# Altium schematic sheet Fonte.SchDoc
size A4
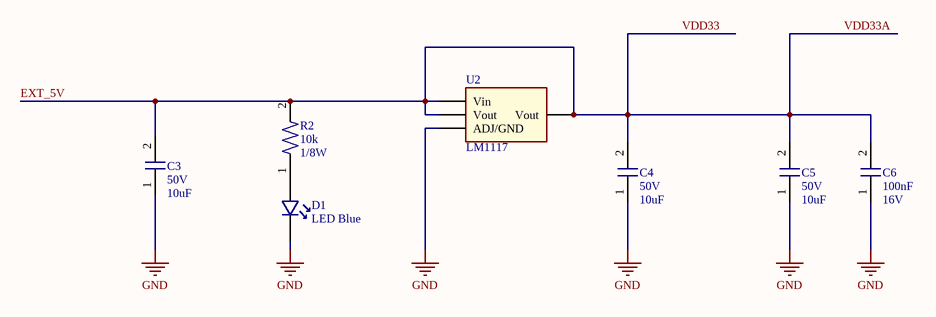
[diagram p0: Fonte.SchDoc]

## Parts
C3  Voltage: 50V  Capacitance: 10uF  [CAP 10uF/50V]  (hidden comment: CAP 10uF/50V)
C4  Voltage: 50V  Capacitance: 10uF  [CAP 10uF/50V]  (hidden comment: CAP 10uF/50V)
C5  Voltage: 50V  Capacitance: 10uF  [CAP 10uF/50V]  (hidden comment: CAP 10uF/50V)
C6  Capacitance: 100nF  Voltage: 16V  [CAP 100nF/16V]  (hidden comment: CAP 100nF/16V)
D1  LED Blue  [LED Blue]
R2  Resistence: 10k  Power: 1/8W  [RES 10k 1% 1/8W]  (hidden comment: RES 0603)
U2  LM1117  [LM1117]

## Nets
GND: C3.1 C4.1 C5.1 C6.1 D1.K U2.1(ADJ/GND)
EXT_5V: C3.2 C4.2 C5.2 C6.2 R2.2 U2.2(Vout) U2.3(Vin) U2.4(Vout)  [also labelled VDD33, VDD33A]
NetD1_A: D1.A R2.1

## Library data of the parts
C3-C5 = CAP  10uF/50V: 10uF ±1% 50V Ceramic Capacitor C0G, NP0 0805 (2012 Metric); Manufacturer 1: Murata Electronics North America; Manufacturer 1 PN: GRM2165C1H102FA01D; Digikey PN: 490-6441-1-ND; Mouser PN: 81-GRM2165C1H102FA01; ComponentLink1Description: Datasheet; ComponentLink1URL: https://www.murata.com/~/media/webrenewal/support/library/catalog/products/capacitor/mlcc/c02e.ashx?la=en-us
C6 = CAP 100nF/16V: 0.1µF ±20% 16V Ceramic Capacitor Y5V (F) 0805 (2012 Metric); Manufacturer 1: Samsung Electro-Mechanics; Manufacturer 1 PN: CL21A106KOQNNWE; Mouser PN: 581-08055C104K4Z4A; Digikey PN: 1276-2894-1-ND; ComponentLink1Description: Specifications; ComponentLink1URL: http://www.samsungsem.com/kr/support/product-search/mlcc/__icsFiles/afieldfile/2018/07/27/CL21A106KOQNNWE.pdf
D1 = LED Blue: Blue 470nm LED Indication - Discrete 3.3V 0805 (2012 Metric); Manufacturer 1: Lite-On Inc.; Manufacturer 1 PN: LTST-C171TBKT
R2 = RES 10k 1% 1/8W: 10 kOhms ±1% 0.125W, 1/8W Chip Resistor 0603 (1608 Metric) Anti-Sulfur, Moisture Resistant Thin Film; Manufacturer 1: Stackpole Electronics Inc.; Manufacturer 1 PN: RNCP0603FTD10K0; Digikey PN: RNCP0603FTD10K0CT-ND; ComponentLink1Description: Datasheet; ComponentLink1URL: http://www.yageo.com/documents/recent/PYu-RC_Group_51_RoHS_L_9.pdf; Mouser PN: 755-ESR03EZPF1002
U2 = LM1117: Linear Voltage Regulator IC Positive Fixed 1 Output 3.3V 1A SOT-223; Manufacturer 1: Diodes Incorporated; Manufacturer 1 PN: AZ1117EH-3.3TRG1; Manufacturer 2 PN: LD1117S33TR; Notes: Every PMIC named 1117 is the same; Manufacturer 2: STMicroelectronics; Digikey PN: AZ1117EH-3.3TRG1DICT-ND; Mouser PN: 621-AZ1117EH-3.3TRG1; ComponentLink1Description: Datasheet; ComponentLink1URL: https://www.diodes.com/assets/Datasheets/AZ1117E.pdf